# Altium schematic sheet H_Bridge.SchDoc
size 431 x 279 mm; SheetNumber: 1; SheetTotal: 1
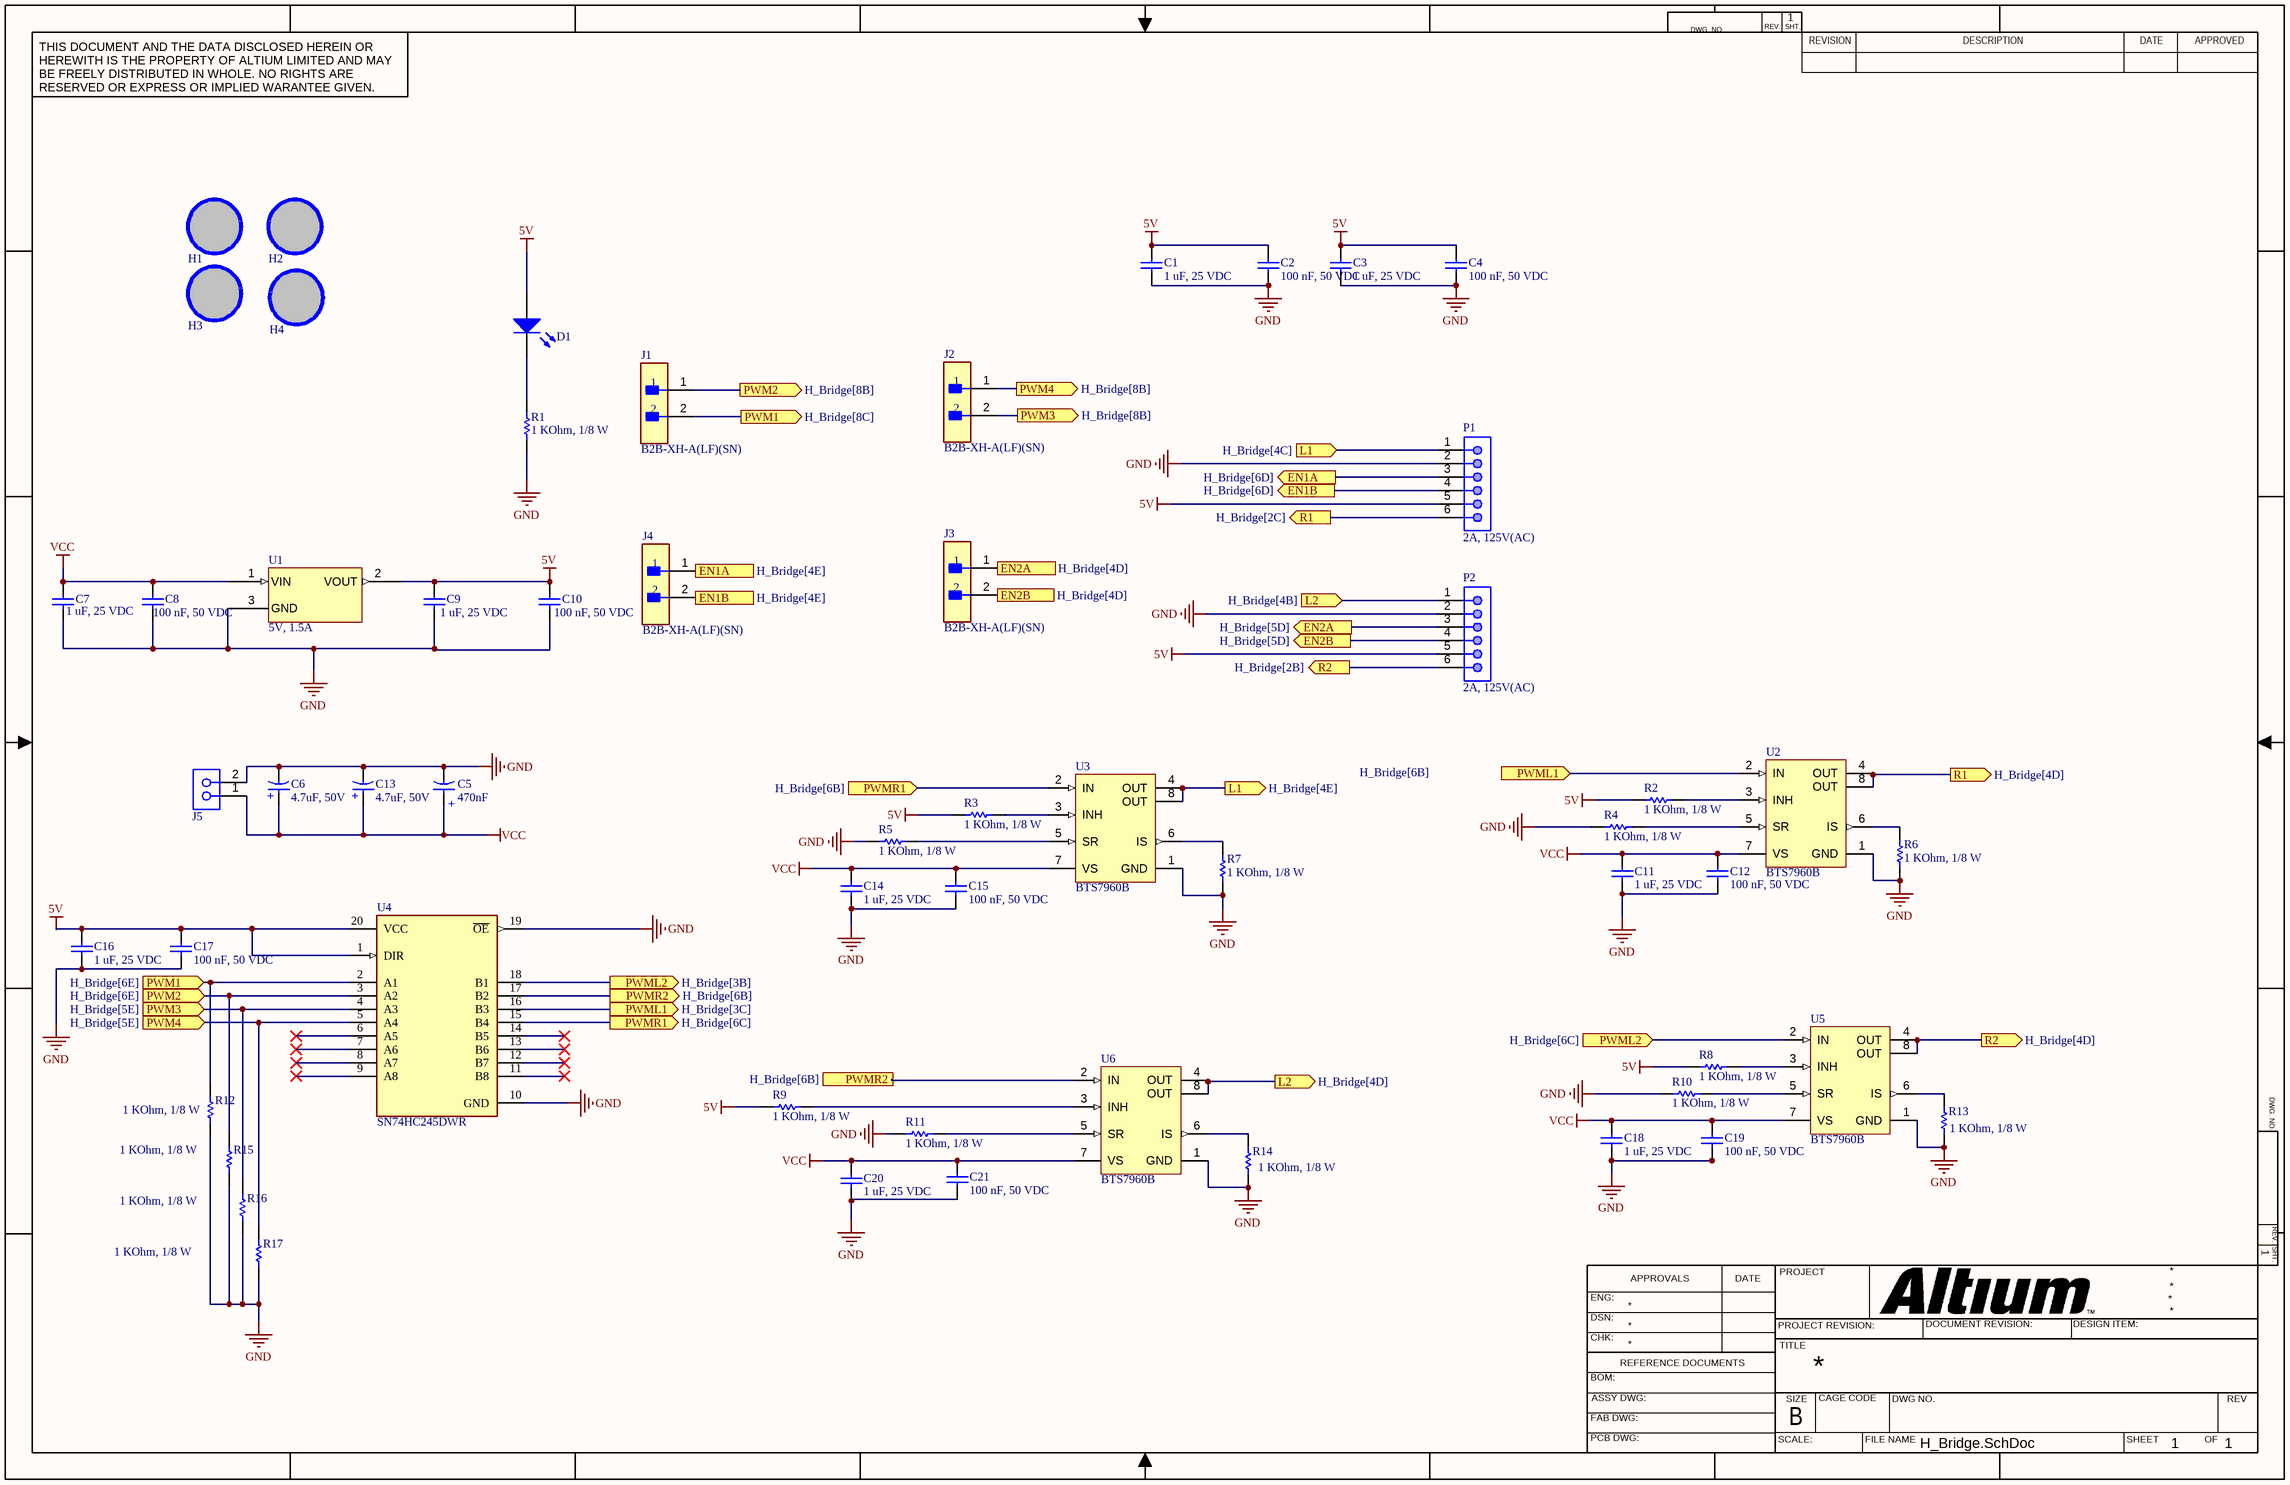
[diagram p0: H_Bridge.SchDoc]

## Parts
C1  1 uF, 25 VDC  [CAP_0805]
C2  100 nF, 50 VDC  [CAP_0805]
C3  1 uF, 25 VDC  [CAP_0805]
C4  100 nF, 50 VDC  [CAP_0805]
C5  470nF  [WCAP-ASLU_D4H5.5]
C6  4.7uF, 50V  [WCAP-ASLI_D4H5.5]
C7  1 uF, 25 VDC  [CAP_0805]
C8  100 nF, 50 VDC  [CAP_0805]
C9  1 uF, 25 VDC  [CAP_0805]
C10  100 nF, 50 VDC  [CAP_0805]
C11  1 uF, 25 VDC  [CAP_0805]
C12  100 nF, 50 VDC  [CAP_0805]
C13  4.7uF, 50V  [WCAP-ASLI_D4H5.5]
C14  1 uF, 25 VDC  [CAP_0805]
C15  100 nF, 50 VDC  [CAP_0805]
C16  1 uF, 25 VDC  [CAP_0805]
C17  100 nF, 50 VDC  [CAP_0805]
C18  1 uF, 25 VDC  [CAP_0805]
C19  100 nF, 50 VDC  [CAP_0805]
C20  1 uF, 25 VDC  [CAP_0805]
C21  100 nF, 50 VDC  [CAP_0805]
D1  LED SMD  [LED_0805_Blue]  (value not drawn)
H1  Hole  [LO KHOAN 3MM]  (value not drawn)
H2  Hole  [LO KHOAN 3MM]  (value not drawn)
H3  Hole  [LO KHOAN 3MM]  (value not drawn)
H4  Hole  [LO KHOAN 3MM]  (value not drawn)
J1  B2B-XH-A(LF)(SN)  [FP-B2B-XH-A_LF_SN-MFG]
J2  B2B-XH-A(LF)(SN)  [FP-B2B-XH-A_LF_SN-MFG]
J3  B2B-XH-A(LF)(SN)  [FP-B2B-XH-A_LF_SN-MFG]
J4  B2B-XH-A(LF)(SN)  [FP-B2B-XH-A_LF_SN-MFG]
J5  4A, 300V  [691418420002]  (value not drawn)
P1  2A, 125V(AC)  [62000611622]
P2  2A, 125V(AC)  [62000611622]
R1  1 KOhm, 1/8 W  [RESISTOR_0805]
R2  1 KOhm, 1/8 W  [RESISTOR_0805]
R3  1 KOhm, 1/8 W  [RESISTOR_0805]
R4  1 KOhm, 1/8 W  [RESISTOR_0805]
R5  1 KOhm, 1/8 W  [RESISTOR_0805]
R6  1 KOhm, 1/8 W  [RESISTOR_0805]
R7  1 KOhm, 1/8 W  [RESISTOR_0805]
R8  1 KOhm, 1/8 W  [RESISTOR_0805]
R9  1 KOhm, 1/8 W  [RESISTOR_0805]
R10  1 KOhm, 1/8 W  [RESISTOR_0805]
R11  1 KOhm, 1/8 W  [RESISTOR_0805]
R12  1 KOhm, 1/8 W  [RESISTOR_0805]
R13  1 KOhm, 1/8 W  [RESISTOR_0805]
R14  1 KOhm, 1/8 W  [RESISTOR_0805]
R15  1 KOhm, 1/8 W  [RESISTOR_0805]
R16  1 KOhm, 1/8 W  [RESISTOR_0805]
R17  1 KOhm, 1/8 W  [RESISTOR_0805]
U1  5V, 1.5A  [TO-263]
U2  BTS7960B  [INF-P-TO-263-7-6_M]
U3  BTS7960B  [INF-P-TO-263-7-6_M]
U4  SN74HC245DWR  [FP-DW0020A-IPC_A]
U5  BTS7960B  [INF-P-TO-263-7-6_M]
U6  BTS7960B  [INF-P-TO-263-7-6_M]

## Ports
EN1A (in, see H_Bridge[4E]), EN1A (out, see H_Bridge[6D]), EN1B (in, see H_Bridge[4E]), EN1B (out, see H_Bridge[6D]), EN2A (in, see H_Bridge[4D]), EN2A (out, see H_Bridge[5D]), EN2B (in, see H_Bridge[4D]), EN2B (out, see H_Bridge[5D]), L1 (in, see H_Bridge[4C]), L1 (out, see H_Bridge[4E]), L2 (in, see H_Bridge[4B]), L2 (out, see H_Bridge[4D]), PWM1 (in, see H_Bridge[6E]), PWM1 (out, see H_Bridge[8C]), PWM2 (in, see H_Bridge[6E]), PWM2 (out, see H_Bridge[8B]), PWM3 (in, see H_Bridge[5E]), PWM3 (out, see H_Bridge[8B]), PWM4 (in, see H_Bridge[5E]), PWM4 (out, see H_Bridge[8B]), PWML1 (in, see H_Bridge[6B]), PWML1 (out, see H_Bridge[3C]), PWML2 (in, see H_Bridge[6C]), PWML2 (out, see H_Bridge[3B]), PWMR1 (in, see H_Bridge[6B]), PWMR1 (out, see H_Bridge[6C]), PWMR2 (in, see H_Bridge[6B]), PWMR2 (out, see H_Bridge[6B]), R1 (out, see H_Bridge[2C]), R1 (out, see H_Bridge[4D]), R2 (out, see H_Bridge[2B]), R2 (out, see H_Bridge[4D])

## Nets
5V: C1.2 C2.2 C3.2 C4.2 C9.2 C10.2 C16.2 C17.2 D1.1(A) P1.5 P2.5 R2.2 R3.2 R8.2 R9.2 U1.2(VOUT) U4.1(DIR) U4.20(VCC)
GND: C1.1 C2.1 C3.1 C4.1 C5.2(N) C6.2(N) C7.1 C8.1 C9.1 C10.1 C11.1 C12.1 C13.2(N) C14.1 C15.1 C16.1 C17.1 C18.1 C19.1 C20.1 C21.1 J5.2 P1.2 P2.2 R1.2 R4.2 R5.2 R6.2 R7.2 R10.2 R11.2 R12.1 R13.1 R14.1 R15.1 R16.1 R17.1 U1.3(GND) U2.1(GND) U3.1(GND) U4.10(GND) U4.19(~{OE}) U5.1(GND) U6.1(GND)
VCC: C5.1(P) C6.1(P) C7.2 C8.2 C11.2 C12.2 C13.1(P) C14.2 C15.2 C18.2 C19.2 C20.2 C21.2 J5.1 U1.1(VIN) U2.7(VS) U3.7(VS) U5.7(VS) U6.7(VS)
EN1A: J4.1 P1.3 ; port EN1A
EN1B: J4.2 P1.4 ; port EN1B
EN2A: J3.1 P2.3 ; port EN2A
EN2B: J3.2 P2.4 ; port EN2B
L1: P1.1 U3.4(OUT) U3.8(OUT) ; port L1
L2: P2.1 U6.4(OUT) U6.8(OUT) ; port L2
PWM1: J1.2 R12.2 U4.2(A1) ; port PWM1
PWM2: J1.1 R15.2 U4.3(A2) ; port PWM2
PWM3: J2.2 R16.2 U4.4(A3) ; port PWM3
PWM4: J2.1 R17.2 U4.5(A4) ; port PWM4
PWML1: U2.2(IN) U4.16(B3) ; port PWML1
PWML2: U4.18(B1) U5.2(IN) ; port PWML2
PWMR1: U3.2(IN) U4.15(B4) ; port PWMR1
PWMR2: U4.17(B2) ; port PWMR2
R1: P1.6 U2.4(OUT) U2.8(OUT) ; port R1
R2: P2.6 U5.4(OUT) U5.8(OUT) ; port R2
NetD1_2: D1.2(K) R1.1
NetR2_1: R2.1 U2.3(INH)
NetR3_1: R3.1 U3.3(INH)
NetR4_1: R4.1 U2.5(SR)
NetR5_1: R5.1 U3.5(SR)
NetR6_1: R6.1 U2.6(IS)
NetR7_1: R7.1 U3.6(IS)
NetR8_1: R8.1 U5.3(INH)
NetR9_1: R9.1 U6.3(INH)
NetR10_1: R10.1 U5.5(SR)
NetR11_1: R11.1 U6.5(SR)
NetR13_2: R13.2 U5.6(IS)
NetR14_2: R14.2 U6.6(IS)

Not connected (* = marked no-connect by the designer): H1 1; H2 1; H3 1; H4 1; U4 6(A5)* 7(A6)* 8(A7)* 9(A8)* 11(B8)* 12(B7)* 13(B6)* 14(B5)*; U6 2(IN)

## Notes on the sheet
- DWG. NO.
- REV.
- SHT.
- THIS DOCUMENT AND THE DATA DISCLOSED HEREIN OR HEREWITH IS THE PROPERTY OF ALTIUM LIMITED AND MAY BE FREELY DISTRIBUTED IN WHOLE. NO RIGHTS ARE RESERVED OR EXPRESS OR IMPLIED WARANTEE GIVEN.
- REVISION
- DESCRIPTION
- DATE
- APPROVED
- ENG:
- APPROVALS
- PROJECT
- DSN:
- CHK:
- REFERENCE DOCUMENTS
- PROJECT REVISION:
- TITLE
- DOCUMENT REVISION:
- DESIGN ITEM:
- BOM:
- FAB DWG:
- PCB DWG:
- ASSY DWG:
- SCALE:
- SIZE
- B
- CAGE CODE
- FILE NAME
- DWG NO.
- SHEET
- OF
- REV
- (in symbol 865080640004) +
- (in symbol CMP-03913-53914652-1) +

## Library data of the parts
C1 C3 C7 C9 C11 C14 C16 C18 C20 = 0108051051025: CAP, size 0805, 1 uF, 25 VDC; Manufacture Name: TDK; Manufacture SN: CGA4J1X8R1E105K125AE; Capacitance: 1 uF; Tolerance: +/-10%; Voltage Rating DC: 25 VDC; ComponentLink2Description: Datasheet; ComponentLink2URL: https://product.tdk.com/system/files/dam/doc/product/capacitor/ceramic/mlcc/catalog/mlcc_automotive_soft_en.pdf?ref_disty=mouser; Operating Temperature: -55 to +125degC; Packaging: Tape and Reel; Mounting Technology: SMT; Size: 0805; Supplier 1 Name: Mouser; Supplier 1 SN: 810-A4J1X815K125AE; Supplier 1 URL: https://www.mouser.vn/ProductDetail/TDK/CGA4J1X8R1E105K125AE?qs=Ii670aiJhr6VRhkBsruYJg%3D%3D&utm_source=mouser-refine-download&utm_medium=file&utm_campaign=CGA4J1X8R1E105K125AE&utm_content=TDK; Supplier 2 Name: Digi-Key; Supplier 2 SN: 445-174807-2-ND; Supplier 2 URL: https://www.digikey.com/en/products/detail/tdk-corporation/cga4j1x8r1e105k125ae/6556490; Supplier 3 Name: thegioiic; Supplier 3 SN: OEM; Supplier 3 URL: N/A; Value: 1 uF, 25 VDC
C2 C4 C8 C10 C12 C15 C17 C19 C21 = 0108051041050: CAP, size 0805, 100 nF, 50 VDC; Manufacture Name: TDK; Manufacture SN: CGA4J2X8R1H104K125AD; Capacitance: 0.1 nF; Tolerance: +/-10%; Voltage Rating DC: 50 VDC; Value: 0.1 nF, 50 VDC; ComponentLink2Description: Datasheet; ComponentLink2URL: https://product.tdk.com/system/files/dam/doc/product/capacitor/ceramic/mlcc/catalog/mlcc_automotive_epoxy_en.pdf?ref_disty=mouser; Operating Temperature: -55 to +125degC; Packaging: Tape and Reel; Mounting Technology: SMT; Size: 0805; Supplier 1 Name: Mouser; Supplier 1 SN: 810-C2012X8R1H104KEP; Supplier 1 URL: https://www.mouser.vn/ProductDetail/TDK/CGA4J2X8R1H104K125AD?qs=LcTL%2F5vFEzExqZqv3rh1qQ%3D%3D&utm_source=mouser-refine-download&utm_medium=file&utm_campaign=CGA4J2X8R1H104K125AD&utm_content=TDK; Supplier 2 Name: Digi-Key; Supplier 2 SN: 445-8810-2-ND; Supplier 2 URL: https://www.digikey.com/en/products/detail/tdk-corporation/cga4j2x8r1h104k125ad/3248169; Supplier 3 Name: thegioiic; Supplier 3 SN: OEM; Supplier 3 URL: N/A
C5 = CMP-03913-53914652-1: 865090640004 WCAP-ASLU Aluminum Electrolytic Capacitors; Tolerance: 20%; Voltage Rating: 50V; Material: Aluminium; Life (Hours): 1000hours; Ripple Current: 4mA; Insulation Resistance: 16.6667MΩ; Leakage Current: 400nA; Polarity: Polar; Capacitance: 470nF; Packaging: Tape & Reel (TR); Max Operating Temperature: 85°C; Min Operating Temperature: -40°C; Height - Seated (Max): 5.5118mm; Diameter: 4mm; Length: 5.5mm; Ripple Current (AC): 4mA; Width: 4.3mm; RoHS: Compliant; Case/Package: Radial; Mount: Surface Mount; REACH SVHC: Unknown; Height: 5.5mm; Voltage Rating (DC): 50V; NexarPartId: 53914652
C6 C13 = 865080640004: V-Chip, D4 x H5.5mm, 4.7uF, 50V; Manufacturer: Wurth Elektronik; Capacitance Tolerance: +/-20%; Dissipation Factor: 12%; Endurance: 2000h; Leakage Current: 3uA; Ripple Current: 55mA; Category: Aluminum Electrolytic Capacitors; ComponentLink2Description: Datasheet Link; ComponentLink2URL: https://www.we-online.com/redexpert/spec/865080640004?ad; Mount: Surface Mount; Operating Temperature Max: 105°C; Operating Temperature Min: -55°C; Packaging: Tape and Reel; Height: 5.5mm; Diameter: 4mm; Capacitance: 4.7uF; Rated Voltage (DC): 50V; Supplier 1 Name: Mouser; Supplier 1 SN: 710-865080640004; Supplier 1 URL: https://www.mouser.vn/ProductDetail/Wurth-Elektronik/865080640004?qs=0KOYDY2FL2%2FjY4kqBxIvAg%3D%3D; Supplier 3 Name: thegioiic; Supplier 3 URL: https://www.thegioiic.com/product/tu-hoa-nhom?prid=6714,5972; Manufacturer Part Number: N/A; Supplier 2 Name: Digi-Key; Supplier 2 SN: N/A; Supplier 2 URL: N/A; Supplier 3 SN: N/A; Value: 4.7uF, 50V
D1 = LED SMD: LED
H1-H4 = Hole: Hole 3mm
J1-J4 = CMP-2000-05888-3: CONN HEADER VERT 2POS 2.5MM; Current Rating: 3A; Voltage Rating: 250V; Number of Contacts: 2; Contact Resistance: 20mR; Wire/Cable Gauge: 22AWG; Insulation Resistance: 1GR; Connector Type: Male Pin; Packaging: Bulk; Contact Material: Brass; Lead Free: Lead Free; Orientation: Straight; Contact Plating: Tin; Max Current Rating: 3A; Termination: Solder; Fastening Type: Detent; Depth: 5.75mm; Housing Material: Polyamide; REACH SVHC: No SVHC; Series: XH; Voltage Rating (AC): 250V; Number of Positions: 2; Color: Natural; Contact Type: Male Pin; Max Voltage Rating (DC): 250V; Pitch: 2.5mm; Lead Pitch: 2.5mm; Mount: Through Hole; Max Operating Temperature: 85°C; Length: 7.4mm; Max Voltage Rating (AC): 250V; Min Operating Temperature: -25°C; Number of Rows: 1; Housing Color: White
J5 = 691418420002: WR-TBL Series 4184 45° Entry, THT, pitch 7.62mm, 2p; Manufacturer: Wurth Elektronik; Modularity: No; ComponentLink1Description: Datasheet Link; ComponentLink1URL: https://www.we-online.com/redexpert/spec/691418420002?ad; ComponentLink2Description: Supplier 1 URL; ComponentLink2URL: N/A; Manufacturer Part Number: 691418420002; Category: Terminal Blocks; Match Code: WR-TBL; Mount: Through Hole; Operating Temperature Max: 120°C; Operating Temperature Min: -30°C; Packaging: Box; Application: Screwless; Number of Pins: 2; Number of Rows: 1; Orientation: 45°; Pitch: 7.62mm; Rated Current: 4A; Working Voltage: 300V; ComponentLink3Description: Supplier 2 URL; ComponentLink3URL: N/A; ComponentLink4Description: Supplier 3 URL; ComponentLink4URL: https://www.thegioiic.com/hb762-2-terminal-khoi-han-pcb-2-cuc-24a-450v-7-62mm; Supplier 1 Name: Mouser; Supplier 1 SN: N/A; Supplier 1 URL: N/A; Supplier 2 Name: Digi-Key; Supplier 2 SN: N/A; Supplier 2 URL: N/A; Supplier 3 Name: thegioiic; Supplier 3 SN: N/A; Supplier 3 URL: https://www.thegioiic.com/hb762-2-terminal-khoi-han-pcb-2-cuc-24a-450v-7-62mm; Value: 4A, 300V
P1 P2 = 62000611622: WR-WTB Male Vertical Shrouded Header, pitch 2mm, 6p; Pin Number: 6; Contact Resistance: 20mOhm; Withstanding Voltage: 800VAC; Working Voltage: 125VAC; ComponentLink1Description: Manufacturer; ComponentLink1URL: http://www.we-online.de; ComponentLink2Description: Datasheet; ComponentLink2URL: https://www.we-online.com/catalog/datasheet/62000611622.pdf; Pitch: 2mm; Published Date: January 2020; Publisher: Wurth Elektronik; Mounting Technology: THT; Packaging: Bag; Operating Temperature: -25 to +85degC; Part Number: 62000611622; Gender: Male; Type: Vertical; Rated Current: 2A; ComponentLink3Description: Global Supply; ComponentLink3URL: https://www.we-online.com/en/components/products/WTB_2_00_MALE_VERTICAL_SHROUDED_HEADER_6200XX11622?sq=62000611622#62000611622; ComponentLink4Description: Global Supply; ComponentLink4URL: https://www.mouser.vn/ProductDetail/Wurth-Elektronik/62000611622?qs=ulEaXIWI0c%2F38WR3e0VejA%3D%3D; Supplier 1 Name: Mouser; Supplier 1 SN: 710-62000611622; Supplier 1 URL: https://www.mouser.vn/ProductDetail/Wurth-Elektronik/62000611622?qs=ulEaXIWI0c%2F38WR3e0VejA%3D%3D; Supplier 2 Name: Digi-Key; Supplier 2 SN: N/A; Supplier 2 URL: N/A; Supplier 3 Name: thegioiic; Supplier 3 SN: N/A; Supplier 3 URL: N/A; Value: 2A, 125V(AC)
R1-R17 = 0008051021: RES, size 0805, 1 KOhm, 1/8 W; Manufacture  Name: Vishay Dale; Manufacture  SN: M55342K06B1E00RS3; Resistance tolerance: +/-1%; Rated Power: 1/8 W; Resistance: 1 KOhm; Size: 0805; Mounting Technology: SMT; Supplier 1 Name: Mouser; Supplier 1 SN: N/A; Supplier 1 URL: N/A; Supplier 2 Name: Digi-Key; Supplier 2 SN: 1135-1001-2-ND; Supplier 2 URL: https://www.digikey.com/en/products/detail/vishay-dale/M55342K06B1E00RS3/2941798; Supplier 3 Name: Thegioiic; Supplier 3 SN: N/A; Supplier 3 URL: https://www.thegioiic.com/dien-tro-1-kohm-0805-1; Value: 1 KOhm, 1/8 W; ComponentLink1Description: Datasheet link; ComponentLink1URL: https://www.vishay.com/docs/31010/rcwpm.pdf; ComponentLink2Description: Supplier 1 URL; ComponentLink2URL: N/A; ComponentLink3Description: Supplier 2 URL; ComponentLink3URL: https://www.digikey.com/en/products/detail/vishay-dale/M55342K06B1E00RS3/2941798; ComponentLink4Description: Supplier 3 URL; ComponentLink4URL: https://www.thegioiic.com/dien-tro-1-kohm-0805-1
U1 = L7805ACD2T_TO-263: Out: 5V, 1.5A; In: 7V to 35V; Pacakge: TO-263; Output Current: 1.5A; Package: TO-263; Voltage Input Maximum: 7V to 35V; Voltage Output: 5V; ComponentLink1Description: Datasheet link; ComponentLink1URL: https://www.st.com/resource/en/datasheet/l78.pdf; ComponentLink2Description: Supplier 1 URL; ComponentLink2URL: https://www.mouser.com/ProductDetail/STMicroelectronics/L7805ACD2T-TR?qs=Ctxo64yJVFuOLXlPPZdJUQ%3D%3D; ComponentLink3Description: Supplier 2 URL; ComponentLink3URL: https://www.digikey.com/en/products/detail/stmicroelectronics/L7805ACD2T-TR/1038230; ComponentLink4Description: Supplier 3 URL; ComponentLink4URL: https://www.thegioiic.com/l7805acd2t-ic-on-ap-5v-1-5a; Supplier 1 Name: Mouser; Supplier 1 SN: 511-L7805ACD2T-TR; Supplier 1 URL: https://www.mouser.com/ProductDetail/STMicroelectronics/L7805ACD2T-TR?qs=Ctxo64yJVFuOLXlPPZdJUQ%3D%3D; Supplier 2 Name: Digi-Key; Supplier 2 SN: 497-7253-2-ND; Supplier 2 URL: https://www.digikey.com/en/products/detail/stmicroelectronics/L7805ACD2T-TR/1038230; Supplier 3 Name: thegioiic; Supplier 3 SN: N/A; Supplier 3 URL: https://www.thegioiic.com/l7805acd2t-ic-on-ap-5v-1-5a; Value: 5V, 1.5A
U2 U3 U5 U6 = CMP-1114-00025-1: High Current PN Half Bridge NovalithIC, -40 to 150 degC, P-TO-263-7-6; Manufacturer: Infineon; Iq (typ): 7 uA; Green: FALSE; ComponentLink1Description: Manufacturer URL; Halogen-free: FALSE; PackageDescription: 7-Pin Plastic Transistor Single Outline Package, 9.9 x 9.2 mm Body, 1.27 mm Pitch; ComponentLink2Description: Datasheet; ComponentLink3Description: Package Specification; ComponentLink1URL: http://www.infineon.com/; ComponentLink2URL: http://www.infineon.com/dgdl/BTS7960_Datasheet.pdf?folderId=db3a304412b407950112b408e8c90004&fileId=db3a304412b407950112b43945006d5d&location=en.Products.Automotive_ICs.Motor_Drivers__Automotive_.Integrated_High_Current_Motor_Drivers__NovalithIC____Trilith; ComponentLink3URL: http://www.infineon.com/dgdl/BTS7970B_Datasheet.pdf?folderId=db3a304412b407950112b408e8c90004&fileId=db3a304412b407950112b43949b36d61&sId=db3a30433d68e984013d7db637dc5e6a; PackageReference: P-TO-263-7-6; PackageVersion: May-06; Mounting Technology: Surface Mount; RevisionNote: Re-Activated Devices; PartNumber: BTS7960B; DatasheetVersion: Rev. 1.1
U4 = CMP-1620-00193-3: IC TRANSCVR NON-INVERT 6V 20SOIC; Logic Function: Transceiver; Number of Circuits: 8; High Level Output Current: -7.8mA; Min Supply Voltage: 2V; Direction: Bidirectional; Propagation Delay: 335ns; Number of Elements: 1; Operating Supply Voltage: 5V; Polarity: Non-Inverting; Quiescent Current: 8uA; Low Level Output Current: 7.8mA; Number of Channels: 8; Width: 7.52mm; Length: 12.8mm; Case/Package: SOIC; Lead Free: Lead Free; Max Supply Voltage: 6V; Max Operating Temperature: 85°C; Mount: Surface Mount; Weight: 0.017662oz; Height: 2.35mm; Contact Plating: Gold; Package Quantity: 1; RoHS Compliant: Yes; Min Operating Temperature: -40°C; Packaging: Tape and Reel; Number of Bits per Element: 8; Number of Outputs: 8; Number of Bits: 8; Number of Pins: 20; REACH SVHC: No SVHC; Turn-On Delay Time: 335ns; Radiation Hardening: No